# EAGLE design LED_Matrix_3_2 (EAGLE 7.7.0)
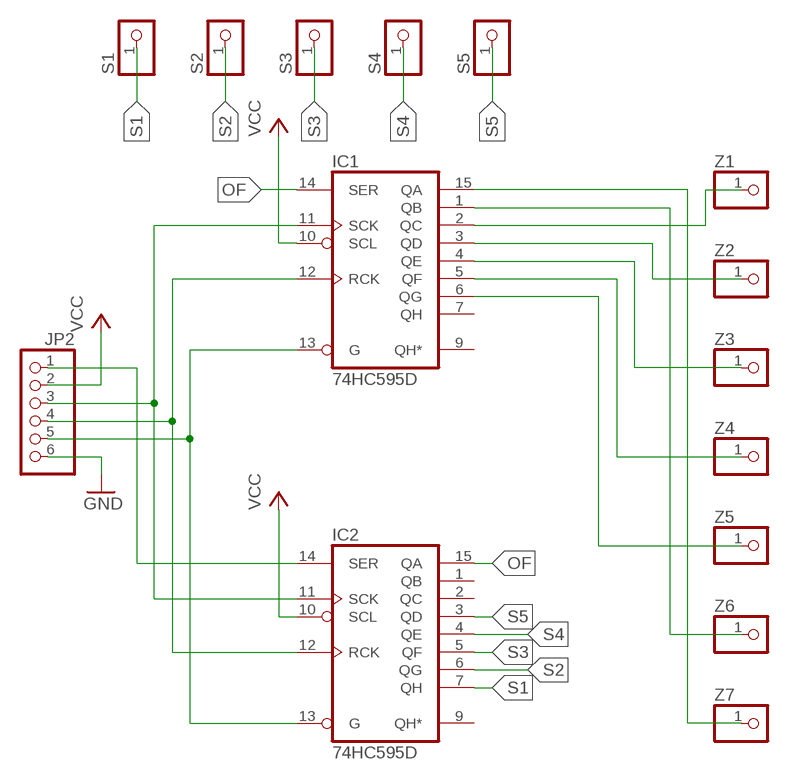
[diagram p0: schematic, sheet 1]

## Parts
IC1  74HC595D  [SO16]
IC2  74HC595D  [SO16]
JP2  PINHD-1X6  [1X06]
S1  PINHD-1X1  [1X01]
S2  PINHD-1X1  [1X01]
S3  PINHD-1X1  [1X01]
S4  PINHD-1X1  [1X01]
S5  PINHD-1X1  [1X01]
Z1  PINHD-1X1  [1X01]
Z2  PINHD-1X1  [1X01]
Z3  PINHD-1X1  [1X01]
Z4  PINHD-1X1  [1X01]
Z5  PINHD-1X1  [1X01]
Z6  PINHD-1X1  [1X01]
Z7  PINHD-1X1  [1X01]

## Nets
GND: JP2.6
N$1: IC1.12(RCK) IC2.12(RCK) JP2.4
N$2: IC1.11(SCK) IC2.11(SCK) JP2.3
N$3: IC2.14(SER) JP2.1
N$6: IC1.13(G) IC2.13(G) JP2.5
N$7: IC1.15(QA) Z7.1
N$8: IC1.1(QB) Z6.1
N$9: IC1.2(QC) Z1.1
N$10: IC1.6(QG) Z5.1
N$11: IC1.5(QF) Z4.1
N$12: IC1.4(QE) Z3.1
N$13: IC1.3(QD) Z2.1
OF: IC1.14(SER) IC2.15(QA)
S1: IC2.7(QH) S1.1
S2: IC2.6(QG) S2.1
S3: IC2.5(QF) S3.1
S4: IC2.4(QE) S4.1
S5: IC2.3(QD) S5.1
VCC: IC1.10(SCL) IC2.10(SCL) JP2.2
Unconnected: IC1.7(QH) IC1.9(QH*) IC2.1(QB) IC2.2(QC) IC2.9(QH*)

## Power pins joined to a net without a drawn wire
GND: IC1.8(GND) IC2.8(GND)
VCC: IC1.16(VCC) IC2.16(VCC)

## Library data of the parts
IC1 IC2 = 74xx-eu:74*595: 8-bit SHIFT REGISTER, output latch
JP2 = pinhead:PINHD-1X6: PIN HEADER
S1-S5 Z1-Z7 = pinhead:PINHD-1X1: PIN HEADER

## Board
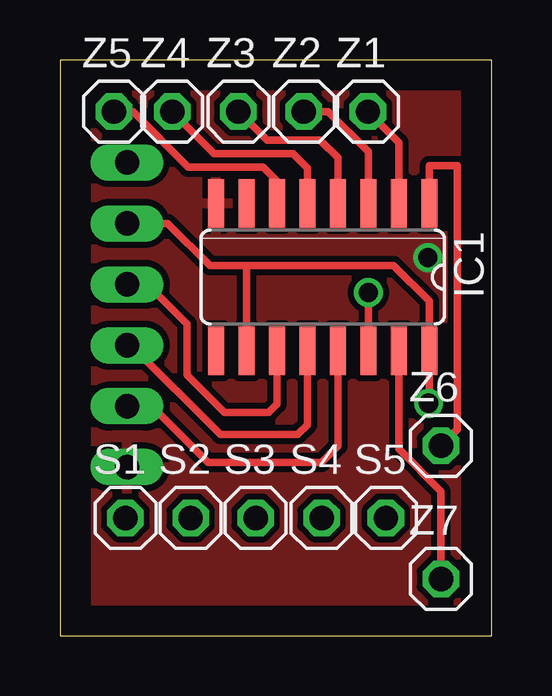
[diagram p1: board, top side]
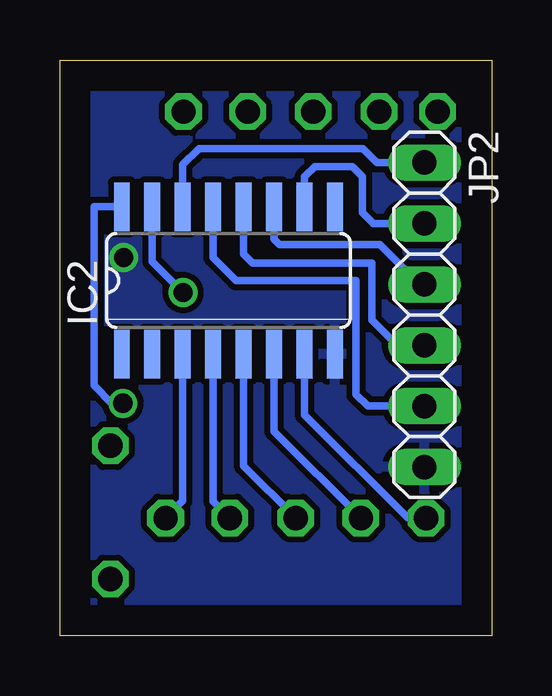
[diagram p2: board, bottom side, seen from below]

Size 18 x 24 mm. Coordinates in mm from the lower left corner, seen from the top.
Outline: 0,0 18,0 18,24 0,24 0,0
Copper layers (1*16): Top 0.035mm / dielectric 1.5mm / Bottom 0.035mm
Design rules "default *": minimum track width 10mil, minimum drill 24mil, track to track 8mil, track to pad 8mil, pad to pad 8mil, via to via 8mil, smd to smd 8mil, copper to edge 50mil, drill to drill 8mil, minimum pad ring 10mil, minimum via ring 8mil, stop-mask expansion 4mil, vias tented up to drill 0mil, thermal gap 10mil
tRestrict: area 5.1,20.3 to 5.6,20.6; area 14.6,10.4 to 14.9,10.6; area 15.9,10.4 to 16.1,10.6; area 9.4,19.3 to 9.7,19.6; area 10.7,19.5 to 11,20; area 12.1,19.5 to 12.3,20; area 13.4,19.5 to 13.5,20.4; area 3,20.9 to 3.2,21.1
bRestrict: area 4.5,20.4 to 4.9,20.8; area 5.5,16.7 to 5.9,17.2; area 9.6,16.1 to 9.8,16.5; area 10.9,16.1 to 11.1,16.4; area 3.5,5.8 to 3.6,5.9

### Footprints (pad centres in the part's own frame; a part is rotated, then mirrored left to right if it is on the bottom)
SO16 = smd 0.66 x 2.032: 1 -4.445,-3.073; 2 -3.175,-3.073; 3 -1.905,-3.073; 4 -0.635,-3.073; 5 0.635,-3.073; 6 1.905,-3.073; 7 3.175,-3.073; 8 4.445,-3.073; 9 4.445,3.073; 10 3.175,3.073; 11 1.905,3.073; 12 0.635,3.073; 13 -0.635,3.073; 14 -1.905,3.073; 15 -3.175,3.073; 16 -4.445,3.073
1X06 = drill 1.016 long: 1 -6.35,0; 2 -3.81,0; 3 -1.27,0; 4 1.27,0; 5 3.81,0; 6 6.35,0
1X01 = drill 1.016 octagon: 1 0,0

### Placement (x,y rotation side)
IC1  10.96,14.95 180 top
IC2  10.97,14.8 0 bottom
JP2  2.8,13.37 270 bottom
S1  2.73,4.9 0 top
S2  5.45,4.9 0 top
S3  8.16,4.9 0 top
S4  10.91,4.9 0 top
S5  13.6,4.9 0 top
Z1  12.85,21.85 0 top
Z2  10.17,21.85 0 top
Z3  7.44,21.85 0 top
Z4  4.68,21.85 0 top
Z5  2.25,21.85 0 top
Z6  15.89,7.92 0 top
Z7  15.89,2.36 0 top

### Tracks (layer width: path | path; a pad name or v marks a point on that pad's centre or on a via)
GND  (via drill 0.8)
  other vias: 15.35,15.76
  pour Bottom (isolate 0.254): 0.09,23.86 0.09,0.17 17.9,0.17 17.9,23.82 11.9,23.82
  pour Top (isolate 0.254): 0.13,23.86 17.91,23.86 17.91,0.17 0.1,0.17 0.1,15.84
N$1
  Top 0.305: IC1.12 10.32,8.78 9.91,8.38 6.7,8.38 2.97,12.1 JP2.4
  Bottom 0.305: IC2.12 10.34,15.9 9.98,15.54 4.99,15.54 4.98,13.16 3.92,12.1 JP2.4
N$2
  Top 0.305: IC1.11 9.05,9.66 8.7,9.3 6.87,9.3 5.3,10.87 5.3,12.98 3.65,14.64 JP2.3
  Bottom 0.305: IC2.11 9.07,16.54 8.84,16.31 4.65,16.31 2.98,14.64 JP2.3
N$3
  Bottom 0.305: IC2.14 12.88,19.63 12.2,20.3 5.36,20.3 4.78,19.72 JP2.1
N$6
  Top 0.305: IC1.13 11.59,7.91 10.9,7.22 6.17,7.22 3.83,9.56 JP2.5
  Bottom 0.305: IC2.13 11.61,15.76 10.65,14.81 5.66,14.81 5.65,10.05 5.16,9.56 JP2.5
N$7
  Top 0.305: Z7.1 15.89,6.02 14.13,7.78 IC1.15
N$8
  Top 0.305: IC1.1 15.4,19.58 16.56,19.58 16.56,8.59 Z6.1
N$9
  Top 0.305: IC1.2 14.13,20.56 Z1.1
N$10
  Top 0.305: Z5.1 3.04,21.85 5.35,19.54 8.46,19.54 9.05,18.95 IC1.6
N$11
  Top 0.305: Z4.1 6.43,20.1 9.72,20.1 10.32,19.5 IC1.5
N$12
  Top 0.305: Z3.1 8.63,20.66 10.85,20.66 11.59,19.92 IC1.4
N$13
  Top 0.305: IC1.3 12.86,20.17 11.19,21.85 Z2.1
N$14
  pour Bottom (isolate 0.254): -0.29,24.27 18.33,24.27 18.33,-0.42 -0.38,-0.42 -0.38,19.46
N$15
  pour Top (isolate 0.254): 18.7,24.52 -0.63,24.52 -0.63,-0.84 18.79,-0.84 18.79,11.15
OF  (via drill 0.8)
  Top 0.305: IC1.14 v12.86,14.3
  Bottom 0.305: IC2.15 14.15,15.59 v12.86,14.3
S1
  Bottom 0.305: S1.1 3.49,4.9 7.8,9.21 IC2.7
S2
  Bottom 0.305: S2.1 9.07,8.52 IC2.6
S3
  Bottom 0.305: S3.1 10.34,7.07 IC2.5
S4
  Bottom 0.305: IC2.4 11.61,5.6 S4.1
S5
  Bottom 0.305: IC2.3 12.88,5.62 S5.1
VCC  (via drill 0.8)
  Top 0.305: JP2.2 4.49,17.18 6.25,15.43 7.78,15.43 | IC1.10 7.78,15.43 | 7.78,15.43 13.92,15.43 15.4,13.94 IC1.16 15.4,9.71 v15.38,9.69
  Bottom 0.305: IC2.10 7.8,19.13 7.37,19.56 5.8,19.56 5.38,19.14 5.38,17.63 4.93,17.18 JP2.2 | IC2.16 16.57,17.88 16.57,10.42 15.84,9.69 v15.38,9.69

### Text on the board
Document: Zusatzanzeiger / -> Steuerungsplatine